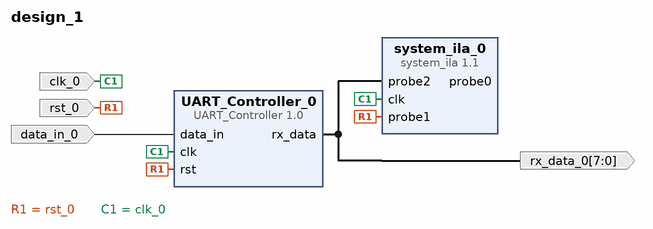
[diagram p0: block diagram of the top level]
# Vivado block design design_1, xc7a100tcsg324-1, Vivado 2019.2
create_bd_design design_1

create_bd_port -dir I -type clk clk_0
create_bd_port -dir I -type rst rst_0
create_bd_port -dir I data_in_0
create_bd_port -dir O -from 7 -to 0 rx_data_0

create_bd_cell -type ip -vlnv xilinx.com:ip:system_ila:1.1 system_ila_0
set_property -dict [list \
  CONFIG.C_MON_TYPE NATIVE \
  CONFIG.C_NUM_OF_PROBES 3 \
  CONFIG.C_PROBE0_TYPE 0 \
  CONFIG.C_PROBE1_TYPE 0 \
  CONFIG.C_PROBE2_TYPE 0 \
] [get_bd_cells system_ila_0]
create_bd_cell -type ip -vlnv xilinx.com:user:UART_Controller:1.0 UART_Controller_0
set_property -dict {CONFIG.baud_rate 115200} [get_bd_cells UART_Controller_0]

# ---- connections ----

connect_bd_net -net rst_0_1 [get_bd_ports rst_0] [get_bd_pins system_ila_0/probe1] [get_bd_pins UART_Controller_0/rst]
connect_bd_net -net data_in_0_1 [get_bd_ports data_in_0] [get_bd_pins UART_Controller_0/data_in]
connect_bd_net -net clk_0_1 [get_bd_ports clk_0] [get_bd_pins system_ila_0/clk] [get_bd_pins UART_Controller_0/clk]
# net r_state_d has one end: system_ila_0/probe0
connect_bd_net -net UART_Controller_0_rx_data [get_bd_pins UART_Controller_0/rx_data] [get_bd_ports rx_data_0] [get_bd_pins system_ila_0/probe2]
set_property HDL_ATTRIBUTE.DEBUG true [get_bd_nets rst_0_1]
set_property HDL_ATTRIBUTE.MARK_DEBUG true [get_bd_nets rst_0_1]
set_property HDL_ATTRIBUTE.DEBUG true [get_bd_nets r_state_d]
set_property HDL_ATTRIBUTE.MARK_DEBUG true [get_bd_nets r_state_d]
set_property HDL_ATTRIBUTE.DEBUG true [get_bd_nets UART_Controller_0_rx_data]
set_property HDL_ATTRIBUTE.MARK_DEBUG true [get_bd_nets UART_Controller_0_rx_data]

validate_bd_design
save_bd_design
